# EAGLE design Poprawiona (EAGLE 6.1)
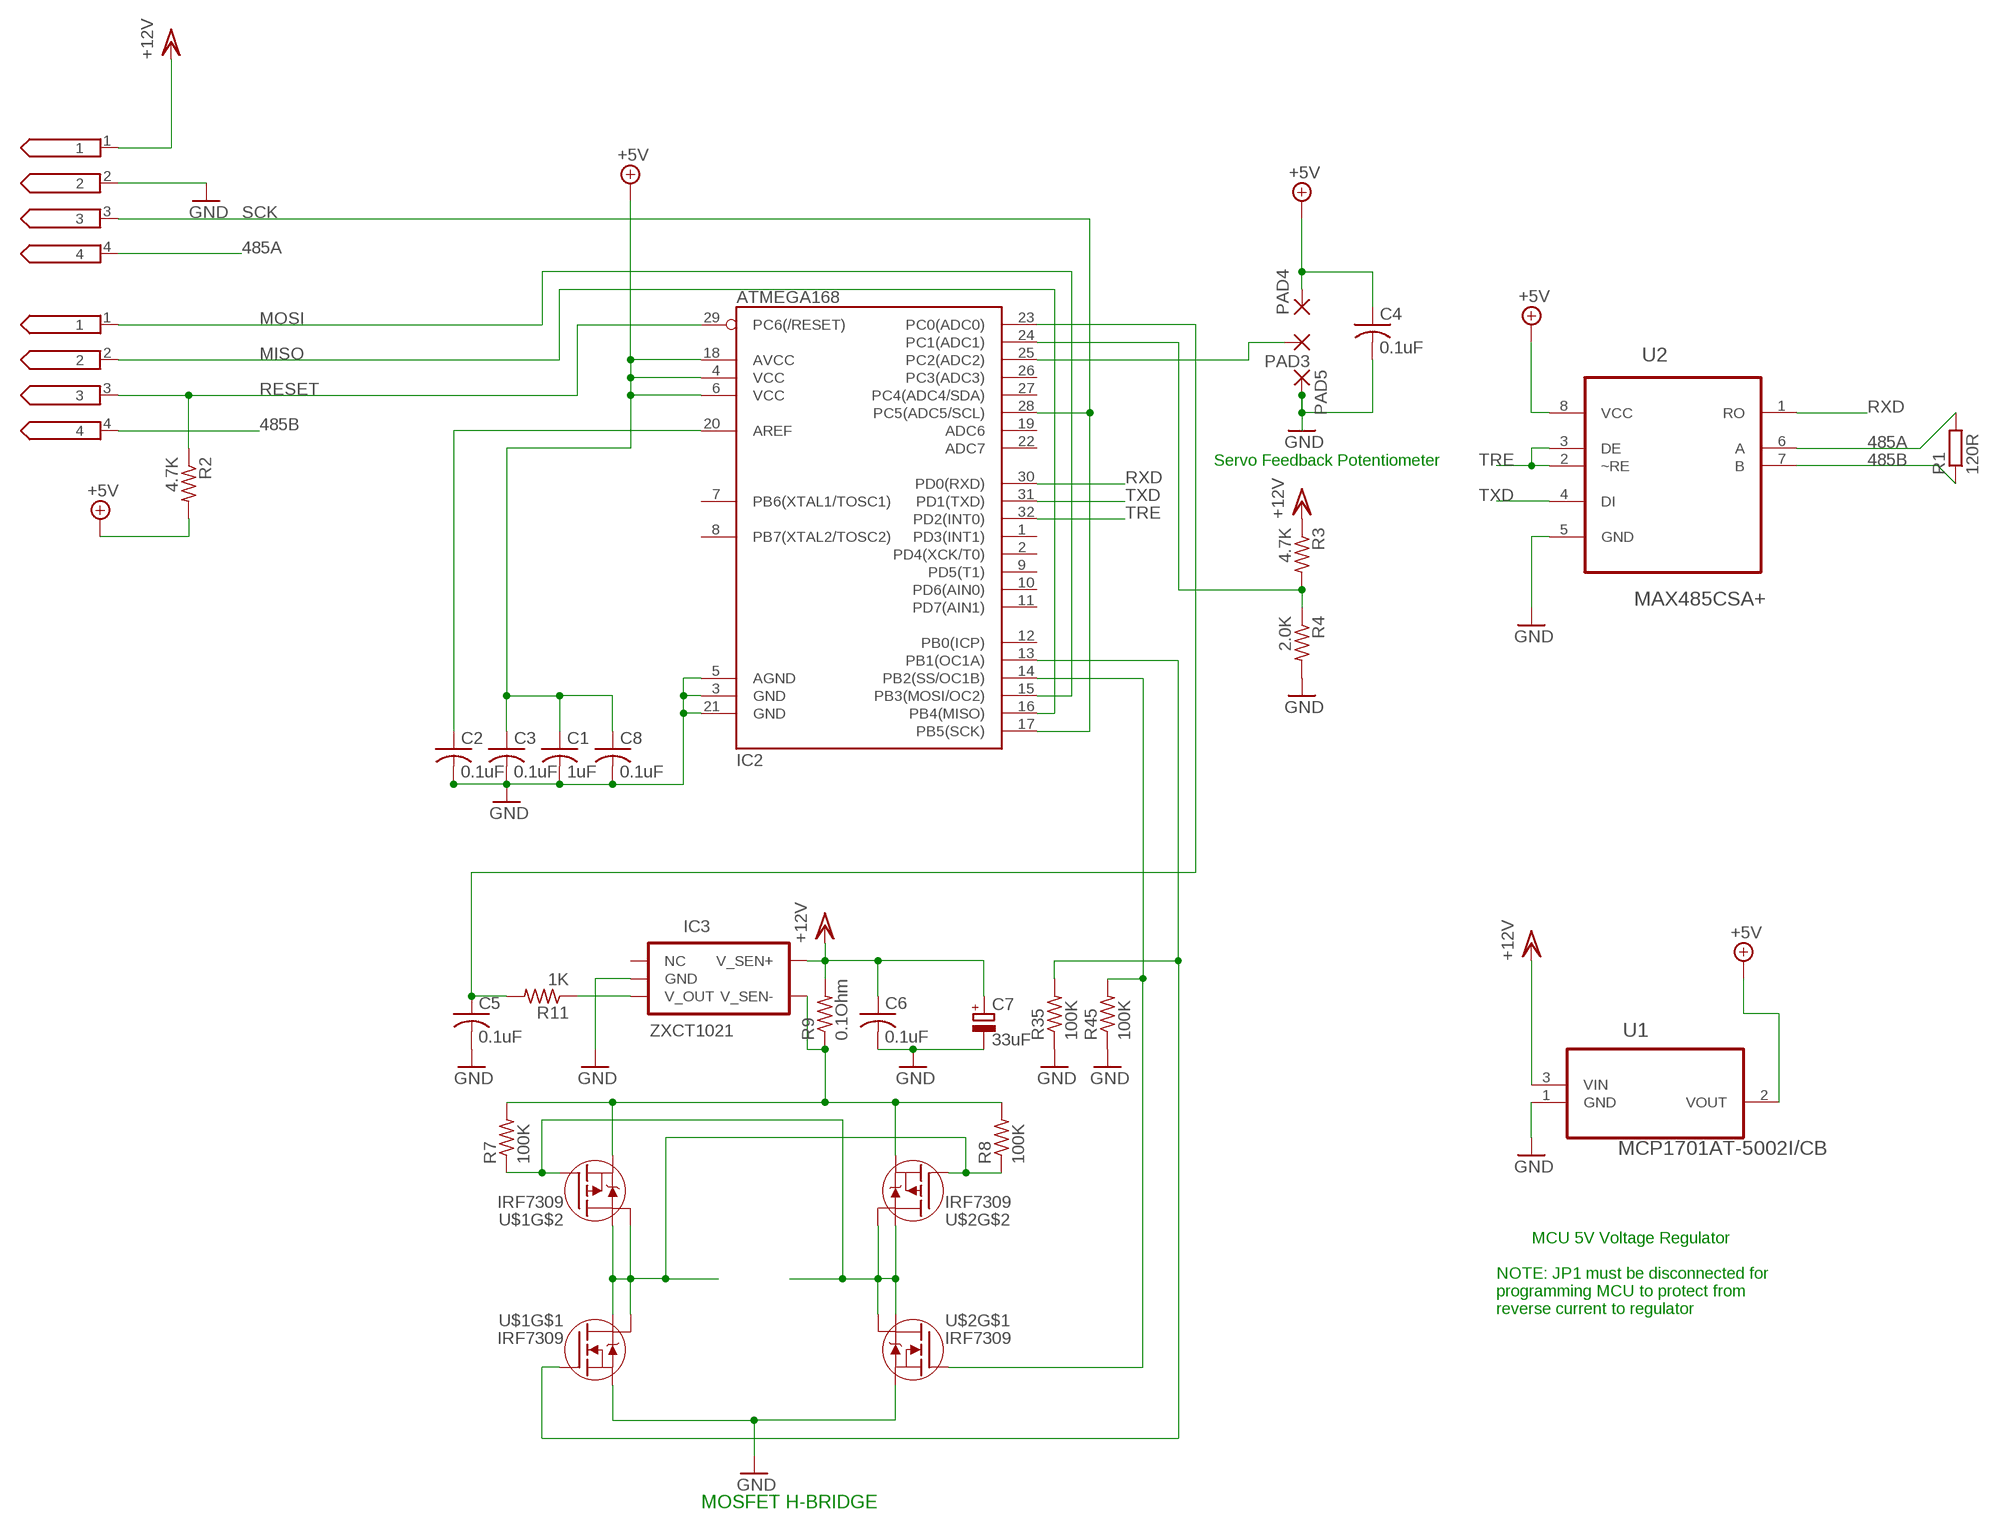
[diagram p0: schematic, sheet 1]

## Parts
C1  1uF  C-USC0603  [C0603]
C2  0.1uF  C-USC0603  [C0603]
C3  0.1uF  C-USC0603  [C0603]
C4  0.1uF  C-USC0603  [C0603]
C5  0.1uF  C-USC0603K  [C0603K]
C6  0.1uF  C-USC0603  [C0603]
C7  33uF  CPOL-EUB/3528-21R  [B/3528-21R]
C8  0.1uF  C-USC0603  [C0603]
IC2  ATMEGA168  [TQFP32-08]
IC3  ZXCT1021  ZXCT1021SOT23-5  [SOT23-5]
JP1  4-EDGEVERSION2  [4-PIN-EDGE-V2]
JP2  4-EDGEVERSION2  [4-PIN-EDGE-V2]
PAD3  1,6/0,8  [1,6/0,8]
PAD4  1,6/0,8  [1,6/0,8]
PAD5  1,6/0,8  [1,6/0,8]
R1  120R  R-EU_R0603  [R0603]
R2  4.7K  R-US_R0603  [R0603]
R3  4.7K  R-US_R0603  [R0603]
R4  2.0K  R-US_R0603  [R0603]
R7  100K  R-US_R0603  [R0603]
R8  100K  R-US_R0603  [R0603]
R9  0.1Ohm  R-US_R0603  [R0603]
R11  1K  R-US_R0603  [R0603]
R35  100K  R-US_R0603  [R0603]
R45  100K  R-US_R0603  [R0603]
U1  MCP1701AT-5002I/CB  [SOT95P255X145-3N]
U2  MAX485CSA+  [SOIC127P600X175-8N]
U$1  IRF7309  [SO8-2]
U$2  IRF7309  [SO8-2]

## Nets
485A: JP1.4 R1.2 U2.6(A)
485B: JP2.4 R1.1 U2.7(B)
+5V: C1.1 C3.1 C4.1 C8.1 IC2.4(VCC) IC2.6(VCC) IC2.18(AVCC) PAD4.1(P) R2.2 U1.2(VOUT) U2.8(VCC)
CURRENT: C5.1 IC2.23(PC0(ADC0)) R11.2
GND: C1.2 C2.2 C3.2 C4.2 C5.2 C6.2 C7.- C8.2 IC2.3(GND) IC2.5(AGND) IC2.21(GND) IC3.2(GND) JP1.2 PAD5.1(P) R4.2 R35.1 R45.1 U1.1(GND) U2.5(GND) U$1.1(S) U$2.1(S)
MISO: IC2.16(PB4(MISO)) JP2.2
MOSI: IC2.15(PB3(MOSI/OC2)) JP2.1
N$4: R7.1 U$1.4(G) U$2.5(D) U$2.6(D) U$2.7(D) U$2.8(D)
N$5: IC3.3(V_OUT) R11.1
N$10: IC3.5(V_SEN-) R7.2 R8.2 R9.1 U$1.3(S) U$2.3(S)
N$11: IC2.14(PB2(SS/OC1B)) R45.2 U$2.2(G)
N$14: IC2.25(PC2(ADC2)) PAD3.1(P)
N$19: IC2.13(PB1(OC1A)) R35.2 U$1.2(G)
N$21: C2.1 IC2.20(AREF)
N$22: IC2.24(PC1(ADC1)) R3.2 R4.1
N$23: R8.1 U$1.5(D) U$1.6(D) U$1.7(D) U$1.8(D) U$2.4(G)
RESET: IC2.29(PC6(/RESET)) JP2.3 R2.1
RXD: IC2.30(PD0(RXD)) U2.1(RO)
SCK: IC2.17(PB5(SCK)) IC2.28(PC5(ADC5/SCL)) JP1.3
TRE: IC2.32(PD2(INT0)) U2.2(~RE) U2.3(DE)
TXD: IC2.31(PD1(TXD)) U2.4(DI)
VCC/2: C6.1 C7.+ IC3.4(V_SEN+) JP1.1 R3.1 R9.2 U1.3(VIN) ; supply symbol labelled +12V
Unconnected: IC2.1(PD3(INT1)) IC2.2(PD4(XCK/T0)) IC2.7(PB6(XTAL1/TOSC1)) IC2.8(PB7(XTAL2/TOSC2)) IC2.9(PD5(T1)) IC2.10(PD6(AIN0)) IC2.11(PD7(AIN1)) IC2.12(PB0(ICP)) IC2.19(ADC6) IC2.22(ADC7) IC2.26(PC3(ADC3)) IC2.27(PC4(ADC4/SDA)) IC3.1(NC)

## Notes on the sheet
- Servo Feedback Potentiometer
- MCU 5V Voltage Regulator
- NOTE: JP1 must be disconnected for
- programming MCU to protect from
- reverse current to regulator
- MOSFET H-BRIDGE

## Library data of the parts
C1-C6 C8 = rcl:C-US: CAPACITOR, American symbol
C7 = rcl:CPOL-EU: POLARIZED CAPACITOR, European symbol
IC2 = MOJA:ATMEGA168
IC3 = MOJA:ZXCT1021: Low offset high-side current monitor http://www.diodes.com/zetex/_pdfs/3.0/pdf/ZXCT1021.pdf
JP1 JP2 = openservo:4-EDGE
PAD3-PAD5 = wirepad:1,6/0,8: THROUGH-HOLE PAD
R1 = resistor:R-EU_: RESISTOR, European symbol
R2-R4 R7-R9 R11 R35 R45 = rcl:R-US_: RESISTOR, American symbol
U1 = mcp1701AT-5002:MCP1701AT-5002I/CB: IC, LDO REG, 250MA, 5.0V; MPN: MCP1701AT-5002I/CB; OC_FARNELL: 1605556; OC_NEWARK: 11N7987; PACKAGE: SOT-23; SUPPLIER: MICROCHIP
U2 = MAX485CSA:MAX485CSA+: ±15kV ESD-Protected, Slew-Rate-Limited, Low-Power, RS-485/RS-422 Transceivers; MPN: MAX485CSA+; OC_FARNELL: 9725954; OC_NEWARK: 68K4795; PACKAGE: SOIC-8; SUPPLIER: Maxim
U$1 U$2 = irf-2:IRF7309

## Board
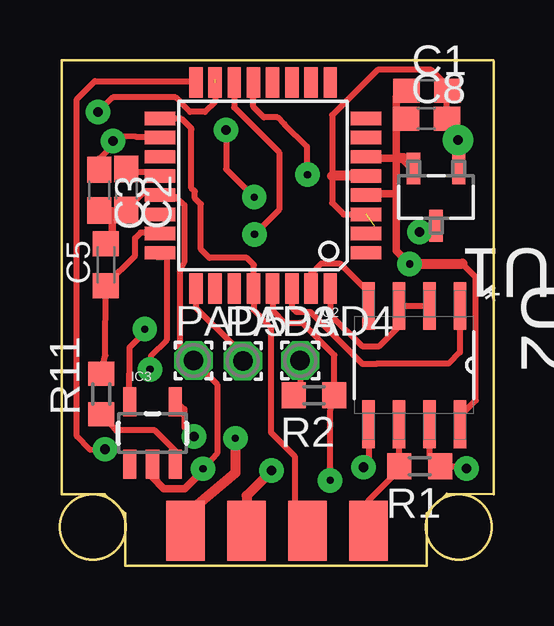
[diagram p1: board, top side]
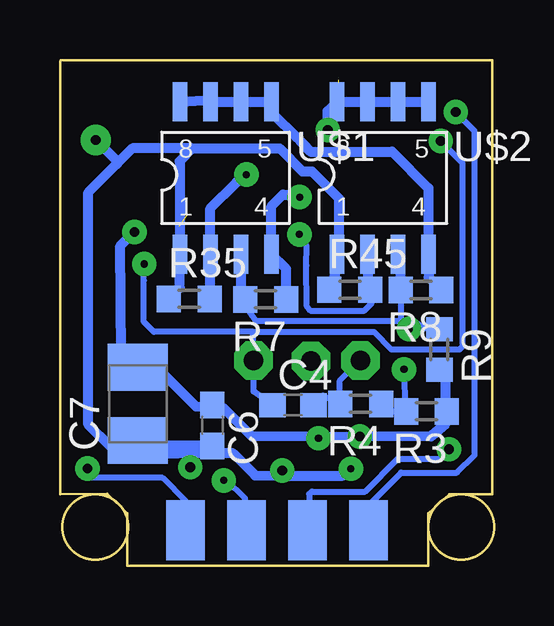
[diagram p2: board, bottom side, seen from below]

Size 18.08 x 21.07 mm. Coordinates in mm from the lower left corner, seen from the top.
Outline: 18.08,21.02 18.08,2.99 16.11,3 15.28,2.18 15.28,0 2.72,0 2.72,2.18 1.86,2.97 0.08,2.97 0.08,21.07 18.05,21.07
Outline: circle at 1.36,1.62 radius 1.36
Outline: circle at 16.61,1.62 radius 1.36
Copper layers (1*16): Top 0.035mm / dielectric 1.5mm / Bottom 0.035mm
Design rules: minimum track width 5mil, minimum drill 10mil, track to track 8mil, track to pad 8mil, pad to pad 8mil, via to via 4mil, smd to smd 2mil, copper to edge 4mil, drill to drill 4mil, minimum pad ring 10mil, minimum via ring 8mil, stop-mask expansion 2mil, vias tented up to drill 0mil, thermal gap 10mil

### Footprints (pad centres in the part's own frame; a part is rotated, then mirrored left to right if it is on the bottom)
C0603 = smd 1.1 x 1: 1 -0.85,0; 2 0.85,0
C0603K = smd 1.05 x 1.08: 1 -0.875,0; 2 0.875,0
B/3528-21R = smd 1.95 x 2.5: + 1.525,0; - -1.525,0
TQFP32-08 = smd 1.27 x 0.559: 1 -4.293,2.8; 2 -4.293,2; 3 -4.293,1.2; 4 -4.293,0.4; 5 -4.293,-0.4; 6 -4.293,-1.2; 7 -4.293,-2; 8 -4.293,-2.8; 17 4.293,-2.8; 18 4.293,-2; 19 4.293,-1.2; 20 4.293,-0.4; 21 4.293,0.4; 22 4.293,1.2; 23 4.293,2; 24 4.293,2.8 | smd 0.559 x 1.27: 9 -2.8,-4.293; 10 -2,-4.293; 11 -1.2,-4.293; 12 -0.4,-4.293; 13 0.4,-4.293; 14 1.2,-4.293; 15 2,-4.293; 16 2.8,-4.293; 25 2.8,4.293; 26 2,4.293; 27 1.2,4.293; 28 0.4,4.293; 29 -0.4,4.293; 30 -1.2,4.293; 31 -2,4.293; 32 -2.8,4.293
SOT23-5 = smd 0.55 x 1.2: 1 -0.95,-1.3; 2 0,-1.3; 3 0.95,-1.3; 4 0.95,1.3; 5 -0.95,1.3
4-PIN-EDGE-V2 = smd 2.5 x 1.6: 1 0.508,4.318; 2 0.508,1.778; 3 0.508,-0.762; 4 0.508,-3.302
1,6/0,8 = drill 0.813 pad 1.6 octagon: 1 0,0
R0603 = smd 1 x 1.1: 1 -0.85,0; 2 0.85,0
SOT95P255X145-3N = smd 0.559 x 1.321: 1 -0.94,-1.194; 2 0.94,-1.194; 3 0,1.194
SOIC127P600X175-8N = smd 1.981 x 0.533: 1 -2.464,1.905; 2 -2.464,0.635; 3 -2.464,-0.635; 4 -2.464,-1.905; 5 2.464,-1.905; 6 2.464,-0.635; 7 2.464,0.635; 8 2.464,1.905
SO8-2 = smd 0.61 x 1.626: 1 -2.54,-2.54; 2 -1.27,-2.54; 3 0,-2.54; 4 1.27,-2.54; 5 1.27,3.81; 6 0,3.81; 7 -1.27,3.81; 8 -2.54,3.81

### Placement (x,y rotation side)
C1  15.29,19.79 0 top
C2  2.76,15.67 270 top
C3  1.63,15.65 270 top
C4  8.37,6.7 0 bottom
C5  1.91,12.54 90 top
C6  11.72,5.84 270 bottom
C7  14.84,6.75 90 bottom
C8  15.27,18.62 0 top
IC2  8.46,15.84 180 top
IC3  3.85,5.53 0 top
JP1  9.55,0.94 90 top
JP2  9.54,2 270 bottom
PAD3  7.62,8.54 0 top
PAD4  10.01,8.55 0 top
PAD5  5.56,8.55 0 top
R1  14.99,4.14 180 top
R2  10.58,7.1 180 top
R3  2.81,6.43 180 bottom
R4  5.55,6.75 180 bottom
R7  9.51,11.1 180 bottom
R8  3.04,11.49 180 bottom
R9  2.27,9.01 270 bottom
R11  1.72,7.16 90 top
R35  12.69,11.12 0 bottom
R45  6,11.5 0 bottom
U1  15.67,15.36 180 top
U2  14.76,8.36 270 top
U$1  10.54,15.52 0 bottom
U$2  3.99,15.52 0 bottom

### Tracks (layer width: path | path; a pad name or v marks a point on that pad's centre or on a via)
485A
  Top 0.254: 12.83,2.23 12.83,1.48 JP1.4 12.85,2.72 14.14,4 R1.2 14.12,4.16 U2.6
485B  (via drill 0.4 pad 1.02)
  Top 0.254: v16.93,4.05 17.22,4.1 R1.1 | 17.08,4.07 R1.1 | 16.06,4.5 R1.1 | U2.7 15.39,4.59 R1.1
  Bottom 0.254: 13.43,1.6 12.84,1.6 JP2.4 12.84,2.7 13.81,3.66 16.93,3.66 v16.93,4.05
+5V  (via drill 0.3 pad 1.02, 0.4 pad 1.02)
  Top 0.254: IC2.18 4.09,17.73 3.94,17.96 3.85,17.87 3.18,17.87 2.55,17.89 2.4,17.73 | 12.75,15.5 12.69,15.5 | 12.75,15.5 IC2.4 | 12.84,17.07 12.92,16.98 | 12.75,15.5 12.77,15.51 | C3.1 1.63,16.96 2.4,17.73 | v2.21,17.69 2.33,17.69 2.4,17.73 | PAD4.1 10.01,7.38 R2.2 | U2.8 16.66,6.23 17.33,6.89 17.33,12.03 16.77,12.59 | 14.06,18.6 14.02,18.6 14.01,18.58
  Top 0.305: v14.57,12.58 14.44,12.69 14.01,13.12 14.01,15.45 | 14.01,15.45 14.01,16.98 | 12.92,16.98 14.01,16.98 | 12.77,15.51 13.95,15.51 14.01,15.45 | 14.01,16.98 14.01,18.58 14.01,19.55 C1.1
  Top 0.406: 12.84,17.07 IC2.6 | v14.57,12.58 14.76,12.59 16.77,12.59 | U1.2 14.3,16.98 14.01,16.98 | C8.1 14.09,18.62 14.06,18.6
  Bottom 0.254: v14.57,12.58 14.58,11.89 14.58,10.16 14.16,9.74 10.04,9.74 | C4.1 10.01,7.27 PAD4.1 10.02,9.26 10.02,9.73 10.04,9.74 | 10.04,9.74 4.99,9.74 4.27,9.02 1.42,9.02 1.3,9.15 1.3,16.78 v2.21,17.69
CURRENT
  Top 0.254: 4.29,13.82 4.12,13.79 IC2.23 4.07,13.84 4,13.91 3.98,13.88 3.36,13.88 3.13,13.65 3.13,12.92 1.91,11.71 C5.1 1.89,8.77 R11.2
GND  (via drill 0.3 pad 1.02, 0.4 pad 1.02, 0.4 pad 1.27)  (1 unrouted)
  Top 0.254: IC2.21 4.14,15.39 4.12,15.41 4.09,15.36 | IC2.21 4.34,15.38 4.42,15.48 4.41,15.36 4.85,15.36 5.2,15.03 5.2,12.68 4.99,12.27 4.99,9.63 4.98,9.12 PAD5.1 6.21,7.9 6.54,7.56 6.54,4.68 v5.96,4.04 | IC2.3 11.82,14.64 11.34,15.12 11.34,16.25 11.34,18.77 13.24,20.67 15.47,20.67 16.14,19.99 C1.2 16.12,19.76 C8.2 | IC2.21 3.88,15.44 3.91,15.46 3.8,15.57 3.51,15.57 C2.2 2.17,14.79 1.65,14.76 C3.2 | 7.66,1.56 JP1.2 | U2.5 12.85,4.31 v12.65,4.1
  Top 0.305: 7.66,1.56 7.81,1.72 | v5.96,4.04 5.96,3.98 5.2,3.22 4.33,3.22 3.84,3.71 IC3.2 | C5.2 2.17,13.67 2.17,14.79
  Top 0.406: IC2.5 11.34,16.24 11.34,16.25 | v8.82,3.97 7.77,2.92 JP1.2 | U1.1 16.59,16.58 v16.59,17.74
  Bottom 0.254: R45.1 6.53,11.25 | U$1.1 13.11,14.15 13.1,13.29 13.1,13.72 | U$2.1 6.56,12.99 6.57,13.08 6.63,12.96 | C4.2 7.13,7.09 R4.2 6.43,7.45 6.42,7.71 PAD5.1 | v12.65,4.1 12.73,4.59 13.18,4.68
  Bottom 0.406: 12.56,17.39 8.93,17.39 7.98,16.44 7.58,16.44 6.45,15.31 6.45,13.06 U$2.1 | 12.56,17.39 13.1,16.84 13.1,13.72 | R45.1 6.63,12.06 6.63,12.96 | 9.03,3.75 6.29,3.75 v5.96,4.04 | 11.58,4.68 10.86,4.68 9.95,3.76 9.03,3.75 | 11.58,4.68 13.18,4.68 14.86,4.69 C7.- | 9.03,3.75 v8.82,3.97 | R35.1 13.08,11.57 U$1.1 | 12.56,17.39 15.06,17.39 15.69,16.76 | 15.69,16.76 16.89,15.56 16.89,5.88 16.01,4.99 C6.2 11.72,4.82 11.58,4.68 | v16.59,17.74 15.71,16.87 15.71,16.73 15.69,16.75 15.69,16.76
MISO  (via drill 0.4 pad 1.02)
  Top 0.254: 5.66,19.72 5.65,20.6 IC2.16 5.6,20.2 1.45,20.2 0.7,19.45 0.7,5.39 1.25,4.84 v1.87,4.85
  Bottom 0.254: JP2.2 7.7,1.68 7.7,2.99 7.58,3.09 5.36,3.09 4,4.45 2.26,4.46 v1.87,4.85
MOSI  (via drill 0.4 pad 1.02)  (1 unrouted)
  Top 0.254: 6.4,20.31 6.46,20.25 | IC2.15 6.46,19.34 6.03,18.91 5.41,18.91 4.82,19.51 2.2,19.51 v1.59,18.9
  Bottom 0.254: 5.25,2.16 JP2.1 5.22,2.52 3.86,3.88 1.54,3.88 0.8,4.61 0.8,18.11 v1.59,18.9
N$4  (via drill 0.3 pad 1.02, 0.4 pad 1.02)
  Top 0.254: v6.92,18.15 6.92,16.53 v8.09,15.36
  Bottom 0.406: R7.1 8.66,12.37 U$1.4 9.27,14.98 8.79,15.46 8.19,15.46 v8.09,15.36 | v6.92,18.15 6.92,18.94 U$2.8 U$2.7 U$2.6 U$2.5
N$5
  Top 0.254: 4.79,4.69 IC3.3 4.79,4.32 4.79,4.8 3.95,5.64 2.33,5.64 1.7,6.36 R11.1
N$10  (via drill 0.3 pad 1.02)
  Top 0.254: IC3.5 2.89,7.59 2.9,8.47 2.9,9.1 3.52,9.71 3.51,9.72 v3.53,9.86
  Bottom 0.254: 3.91,10.18 3.3,10.18 2.95,9.87 3.3,10.16 2.93,9.91 | 3.91,10.18 9.9,10.19 10.48,11.04 | R9.1 2.93,9.91 | 2.93,9.91 2.91,9.88 v3.53,9.86 | R8.2 3.89,10.2 3.91,10.18
  Bottom 0.406: 10.48,11.04 10.32,11.31 R7.2 10.54,11.28 U$1.3 | R8.2 3.89,12.88 U$2.3
N$11  (via drill 0.3 pad 1.02)
  Top 0.254: v8.1,13.81 9.13,14.84 9.13,17.22 7.26,19.1 IC2.14
  Bottom 0.254: v8.1,13.81 8.04,13.64 7.8,13.32 7.81,12.5 7.8,10.84 7.65,10.63 5.4,10.63 5.09,10.94 5.09,11.44 R45.2
  Bottom 0.406: U$2.2 5.26,11.61 R45.2
N$14
  Top 0.254: 5.66,11.21 IC2.25 5.67,10.75 7.25,9.16 PAD3.1
N$19  (via drill 0.3 pad 1.02)
  Top 0.254: IC2.13 8.06,19.12 8.5,18.68 9.07,18.68 9.35,18.41 10.3,17.47 10.3,16.28 10.29,16.28 v10.31,16.3
  Bottom 0.254: 10.38,16.35 v10.31,16.3
  Bottom 0.406: 10.38,16.35 10.72,15.98 11.81,14.89 U$1.2 11.81,11.14 R35.2
N$21
  Top 0.254: IC2.20 4.2,16.19 4.12,16.2 4.05,16.31 3.93,16.18 3.71,16.4 2.88,16.4 C2.1
N$22  (via drill 0.3 pad 1.02)
  Top 0.254: IC2.24 4,12.88 4.38,12.88 4.45,12.94 4.45,9.4 3.79,8.74 3.79,8.22 v3.75,8.18
  Bottom 0.254: v3.75,8.18 3.75,8.22 R3.2 4.71,6.44 R4.1
N$23
  Bottom 0.406: U$1.8 11.75,19.42 11.71,19.38 U$1.7 U$1.6 U$1.5 9.17,18.8 8.24,17.87 7.65,17.25 4.24,17.25 2.73,15.74 2.73,12.99 U$2.4 2.72,12.02 R8.1
RESET  (via drill 0.3 pad 1.02)
  Top 0.254: IC2.29 8.86,10.64 9.37,10.12 10.09,10.12 11.43,8.78 R2.1 | R2.1 11.81,7 | v11.25,3.56 11.25,6.44 R2.1
  Bottom 0.254: JP2.3 10.37,1.55 10.37,2.81 11.13,3.56 v11.25,3.56
RXD
  Top 0.254: IC2.30 9.66,10.77 9.84,10.58 10.43,10.58 12.6,8.41 13.2,8.41 13.21,8.42 16.19,8.42 16.66,8.89 U2.1
SCK
  Top 0.254: 8.08,11.39 8.05,11.36 8.05,11.38 | 8.08,11.39 8.08,12.54 7.79,12.83 6.23,12.83 5.87,13.19 5.87,15.06 5.62,15.32 5.62,15.6 5.48,15.74 5.48,18.18 5.49,18.19 5.49,18.2 5.07,18.62 4.27,18.62 4.25,18.64 IC2.17 | 8.05,11.38 8.04,11.38 | 8.05,11.38 8.06,11.36 8.06,11.34 8.03,11.31 8.07,11.27 8.07,10.66 8.79,9.93 8.79,5.55 9.78,4.56 9.78,2.26 JP1.3 | 8.08,11.39 8.06,11.41 IC2.28
TRE
  Top 0.254: IC2.32 11.31,11.55 11.32,11.56 | 11.26,11.44 IC2.32 | IC2.32 11.27,10.47 12.59,9.15 13.31,9.15 14.12,9.96 U2.3 U2.2
TXD
  Top 0.254: IC2.31 10.46,12.18 10.89,12.6 11.65,12.6 12.85,11.39 U2.4
VCC/2  (via drill 0.3 pad 1.02, 0.4 pad 1.02)
  Top 0.254: IC3.4 5.18,6.52 5.18,5.76 v5.59,5.39
  Top 0.406: v7.3,5.31 7.3,3.86 5.21,2.1 5.21,1.48 JP1.1 | v14.98,13.91 15.12,13.88 15.05,13.97 U1.3
  Bottom 0.406: 2.01,6.42 2.01,5.92 2.62,5.39 5.49,5.37 | 5.49,5.37 v5.59,5.39 | 7.29,5.37 5.49,5.37 | v7.3,5.31 7.29,5.37 | 7.29,5.37 10.02,5.39 10.09,5.39 11.28,6.58 11.57,6.59 | 11.57,6.59 12.41,6.63 14.05,8.27 C7.+ 15.04,8.27 15.53,8.77 15.56,13.32 v14.98,13.91 | 2.01,6.42 2.01,7.89 R9.2 | C6.1 11.67,6.69 11.57,6.59 | R3.1 2,6.43 2.01,6.42